# EAGLE schematic mod_mains_presence (EAGLE 8.4.1)
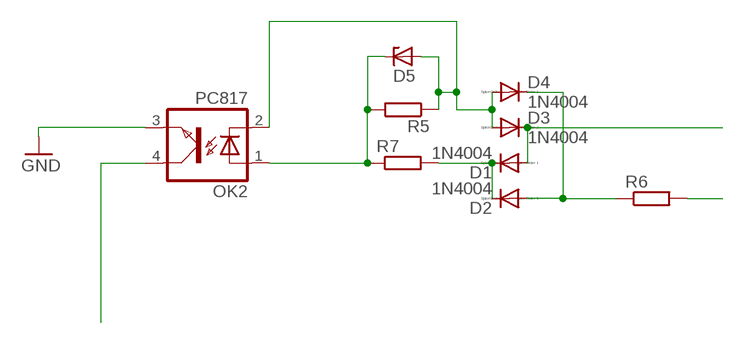
[diagram p0: schematic, sheet 1]

## Parts
D1  1N4004  [DO41-10]
D2  1N4004  [DO41-10]
D3  1N4004  [DO41-10]
D4  1N4004  [DO41-10]
D5  ZENER-DIODEDO34-7  [DO34Z7]
OK2  PC817  [DIL04]
R5  R-EU_0204/5  [0204/5]
R6  R-EU_0204/7  [0204/7]
R7  R-EU_0204/7  [0204/7]

## Nets
GND: OK2.3(EMIT)
N$8: D3.A D4.A D5.A OK2.2(C) R5.1
N$9: D5.C OK2.1(A) R5.2 R7.1
N$11: D1.C D2.C R7.2
N$12: OK2.4(COL)
N$13: D1.A D3.C
N$15: D2.A D4.C R6.1
N$16: R6.2

## Library data of the parts
D1-D4 = diode:1N4004: DIODE general purpose rectifier, 1 A
D5 = diode:ZENER-DIODE: Z-Diode
OK2 = optocoupler:PC817: SHARP OPTO COUPLER; MPN: PC817X4J000F; OC_FARNELL: 9707727; OC_NEWARK: 97K7059
R5-R7 = resistor:R-EU_: RESISTOR, European symbol